# EAGLE design schematic (EAGLE 7.5.0)
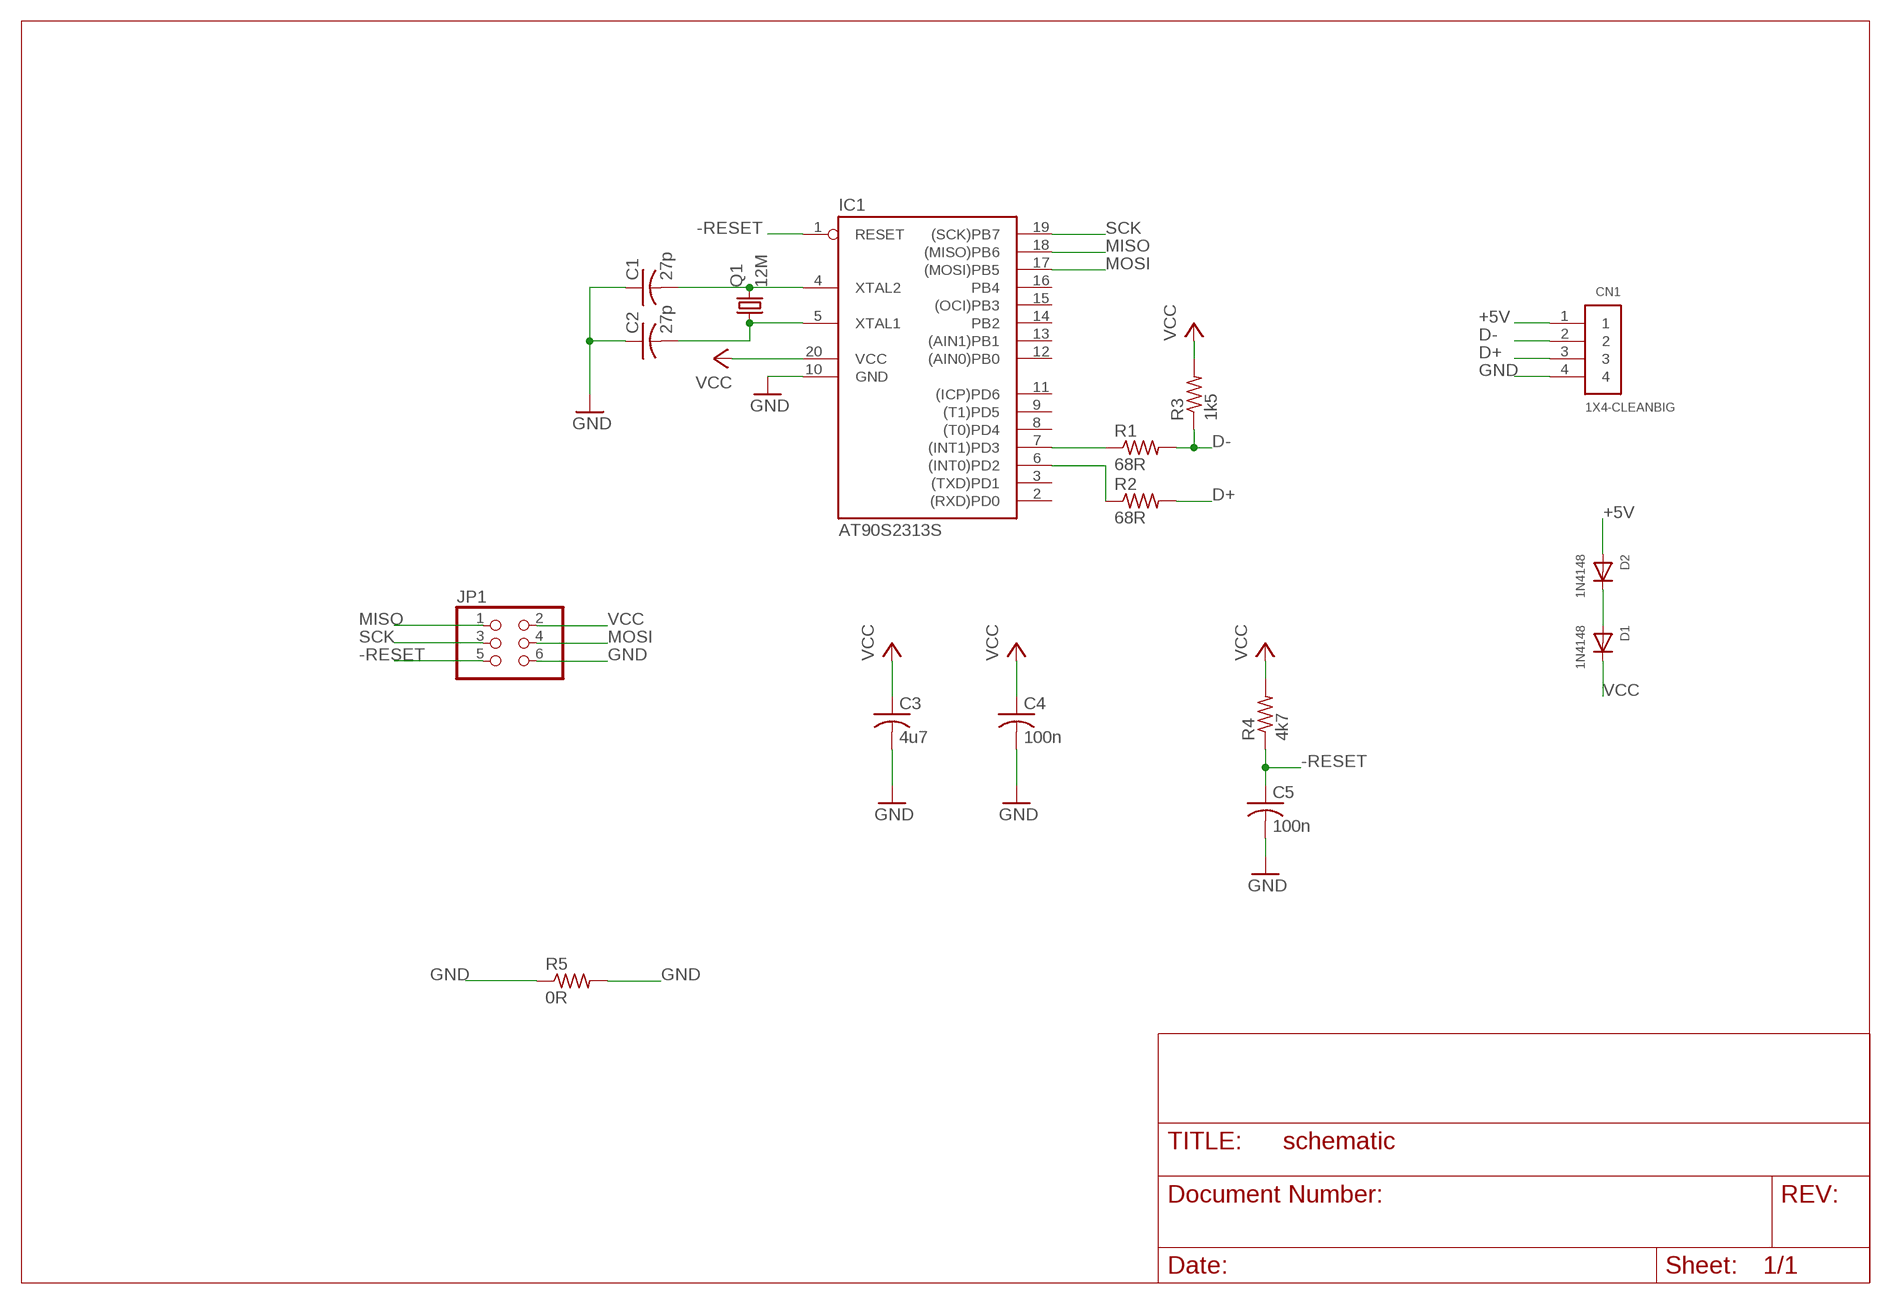
[diagram p0: schematic, sheet 1]

## Parts
C1  27p  C-USC0805  [C0805]
C2  27p  C-USC0805  [C0805]
C3  4u7  C-USC0805  [C0805]
C4  100n  C-USC0805  [C0805]
C5  100n  C-USC0805  [C0805]
CN1  1X4-CLEANBIG  [1X04-CLEANBIG]
D1  1N4148  DIODESMA  [SMADIODE]
D2  1N4148  DIODESMA  [SMADIODE]
IC1  AT90S2313S  [SO20L]
JP1  PINHD-2X3  [2X03]
Q1  12M  CRYSTALHC49UP  [HC49UP]
R1  68R  R-US_R0805  [R0805]
R2  68R  R-US_R0805  [R0805]
R3  1k5  R-US_R0805  [R0805]
R4  4k7  R-US_R0805  [R0805]
R5  0R  R-US_R1206  [R1206]

## Nets
+5V: CN1.1 D2.A
-RESET: C5.1 IC1.1(RESET) JP1.5 R4.1
D+: CN1.3 R2.2
D-: CN1.2 R1.2 R3.1
GND: C1.1 C2.1 C3.2 C4.2 C5.2 CN1.4 IC1.10(GND) JP1.6 R5.1 R5.2
MISO: IC1.18((MISO)PB6) JP1.1
MOSI: IC1.17((MOSI)PB5) JP1.4
N$1: C1.2 IC1.4(XTAL2) Q1.2
N$2: C2.2 IC1.5(XTAL1) Q1.1
N$3: IC1.7((INT1)PD3) R1.1
N$4: D1.A D2.C
N$5: IC1.6((INT0)PD2) R2.1
SCK: IC1.19((SCK)PB7) JP1.3
VCC: C3.1 C4.1 D1.C IC1.20(VCC) JP1.2 R3.2 R4.2
Unconnected: IC1.2((RXD)PD0) IC1.3((TXD)PD1) IC1.8((T0)PD4) IC1.9((T1)PD5) IC1.11((ICP)PD6) IC1.12((AIN0)PB0) IC1.13((AIN1)PB1) IC1.14(PB2) IC1.15((OCI)PB3) IC1.16(PB4)

## Library data of the parts
C1-C5 = adafruit:C-US: CAPACITOR, American symbol
CN1 = adafruit:1X4: 4-pin connector
D1 D2 = adafruit:DIODE: Diode SMADIODE - SMA Surface Mount Package 20V 1A Schottky Diode Digikey: 641-1014-6-ND DO-1N4148 - Through Hole Small Current Diode SOD-123 20V 1 A (.5mV Vf) Schottky Diode - Digikey: MBRX120TPMSCT-ND SOD-323 10V 570mA (.38mV Vf, 3ns) Schottky Diode - Digikey: ZLLS410CT-ND SOD-523 30V 30mA Schottky Diode (RB751S-40TE61) - Digikey: RB751S-40TE61CT-ND SOT23-R/W - SOT23 Package (R = Solder Paste/Reflow Ovens, W = Hand-Soldering) BAT54Film 40V 300mA - Digikey: 497-7162-1-ND
IC1 = atmel:AT90S2313: MICROCONTROLLER 2 Kbytes FLASH 128 bytes SRAM 128 bytes EEPROM UART; OC_FARNELL: unknown; OC_NEWARK: unknown
JP1 = pinhead:PINHD-2X3: PIN HEADER
Q1 = adafruit:CRYSTAL: CRYSTAL; OC_FARNELL: unknown; OC_NEWARK: unknown
R1-R5 = adafruit:R-US_: RESISTOR, American symbol

## Board
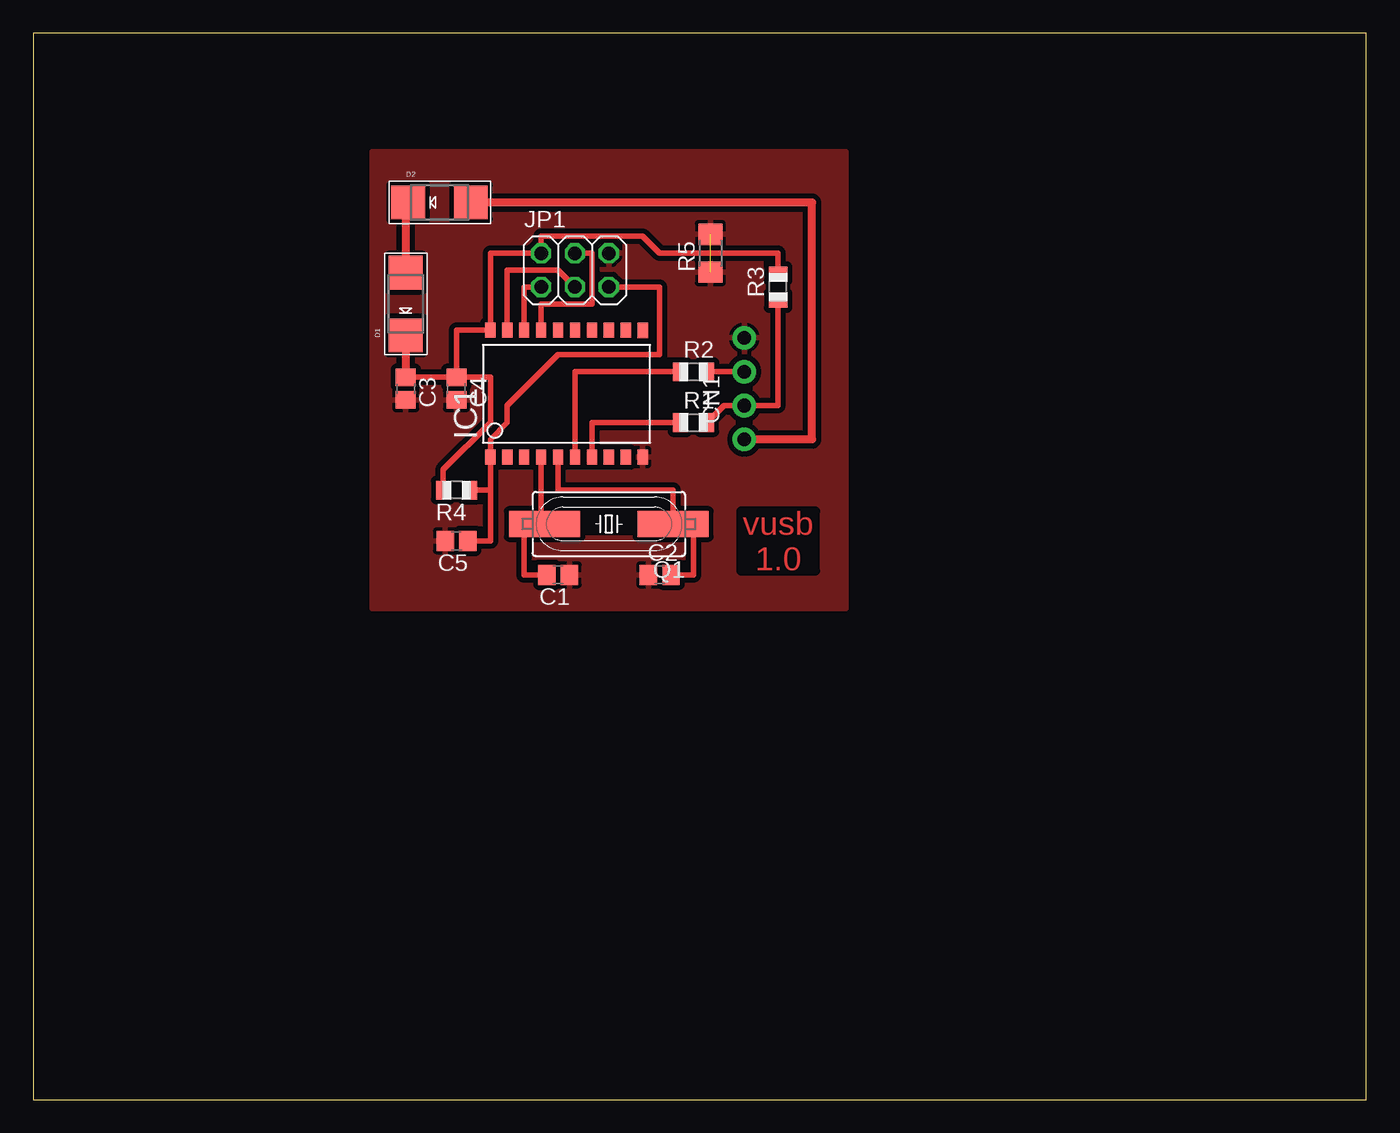
[diagram p1: board, top side]

Size 100 x 80 mm. Coordinates in mm from the lower left corner, seen from the top.
Outline: 0,0 100,0 100,80 0,80 0,0
Copper layers (1*16): Top 0.035mm / dielectric 1.5mm / Bottom 0.035mm
Design rules "default *": minimum track width 10mil, minimum drill 10mil, track to track 15mil, track to pad 15mil, pad to pad 15mil, via to via 15mil, smd to smd 15mil, copper to edge 40mil, drill to drill 4mil, minimum pad ring 10mil, minimum via ring 8mil, stop-mask expansion 4mil, vias tented up to drill 0mil, thermal gap 10mil
tRestrict: area 41.3,42.5 to 45.1,43.8

### Footprints (pad centres in the part's own frame; a part is rotated, then mirrored left to right if it is on the bottom)
C0805 = smd 1.3 x 1.5: 1 -0.85,0; 2 0.85,0
1X04-CLEANBIG = drill 1.016 pad 1.778: 1 -3.81,0; 2 -1.27,0; 3 1.27,0; 4 3.81,0
SMADIODE = smd 2.54 x 2.54: A 2.349,0; C -2.349,0
SO20L = smd 0.762 x 1.143: 1 -5.08,-5.131; 2 -3.81,-5.131; 3 -2.54,-5.131; 4 -1.27,-5.131; 5 0,-5.131; 6 1.27,-5.131; 7 2.54,-5.131; 8 3.81,-5.131; 9 5.08,-5.131; 10 6.35,-5.131; 11 6.35,4.369; 12 5.08,4.394; 13 3.81,4.394; 14 2.54,4.394; 15 1.27,4.394; 16 0,4.394; 17 -1.27,4.394; 18 -2.54,4.394; 19 -3.81,4.394; 20 -5.08,4.394
2X03 = drill 1.016 octagon: 1 -2.54,-1.27; 2 -2.54,1.27; 3 0,-1.27; 4 0,1.27; 5 2.54,-1.27; 6 2.54,1.27
HC49UP = smd 5.334 x 1.93: 1 -4.826,0; 2 4.826,0
R0805 = smd 1.1 x 1.4: 1 -1,0; 2 1,0
R1206 = smd 1.6 x 1.803: 1 -1.422,0; 2 1.422,0

### Placement (x,y rotation side)
C1  39.37,39.37 180 top
C2  46.99,39.37 0 top
C3  27.94,53.34 270 top
C4  31.75,53.34 270 top
C5  31.75,41.91 180 top
CN1  53.34,53.34 90 top
D1  27.94,59.69 90 top
D2  30.48,67.31 0 top
IC1  39.37,53.34 0 top
JP1  40.64,62.23 0 top
Q1  43.18,43.18 180 top
R1  49.53,50.8 0 top
R2  49.53,54.61 0 top
R3  55.88,60.96 90 top
R4  31.75,45.72 180 top
R5  50.8,63.5 90 top

### Tracks (layer width: path | path; a pad name or v marks a point on that pad's centre or on a via)
+5V
  Top 0.61: CN1.1 58.42,49.53 58.42,67.31 D2.A
-RESET
  Top 0.406: 34.29,45.72 IC1.1 34.29,49.53 35.56,50.8 35.56,52.07 39.37,55.88 46.99,55.88 46.99,60.96 JP1.5 | R4.1 34.29,45.72 | 34.29,45.72 34.29,41.91 C5.1
D+
  Top 0.406: R2.2 CN1.3
D-
  Top 0.406: R1.2 51.8,52.07 CN1.2 55.88,52.07 R3.1
GND  (1 unrouted)
  pour Top: 25.4,71.12 25.4,36.83 60.96,36.83 60.96,71.12
MISO
  Top 0.406: IC1.18 36.83,60.96 JP1.1
MOSI
  Top 0.406: IC1.17 38.1,59.69 41.91,59.69 41.91,63.5 JP1.4
N$1
  Top 0.406: IC1.4 38.1,43.18 | C1.2 36.83,39.37 36.83,43.18 38.1,43.18 | 38.1,43.18 Q1.2
N$2
  Top 0.406: IC1.5 39.37,45.72 48.01,45.72 Q1.1 49.53,43.18 49.53,39.37 C2.2
N$3
  Top 0.406: IC1.7 41.91,50.8 R1.1
N$4
  Top 0.61: D2.C 27.94,67.31 D1.A
N$5
  Top 0.406: IC1.6 40.64,54.61 R2.1
SCK
  Top 0.406: IC1.19 35.56,62.23 39.37,62.23 JP1.3
VCC
  Top 0.406: C3.1 C4.1 | C4.1 31.75,57.73 IC1.20 34.29,63.5 JP1.2 38.1,64.77 45.72,64.77 46.99,63.5 55.88,63.5 R3.2 | C4.1 34.29,54.19 34.29,50.8 30.75,47.26 R4.2
  Top 0.61: D1.C C3.1

### Text on the board
Top: vusb / 1.0